# EAGLE design uino-328th (EAGLE 7.7.0)
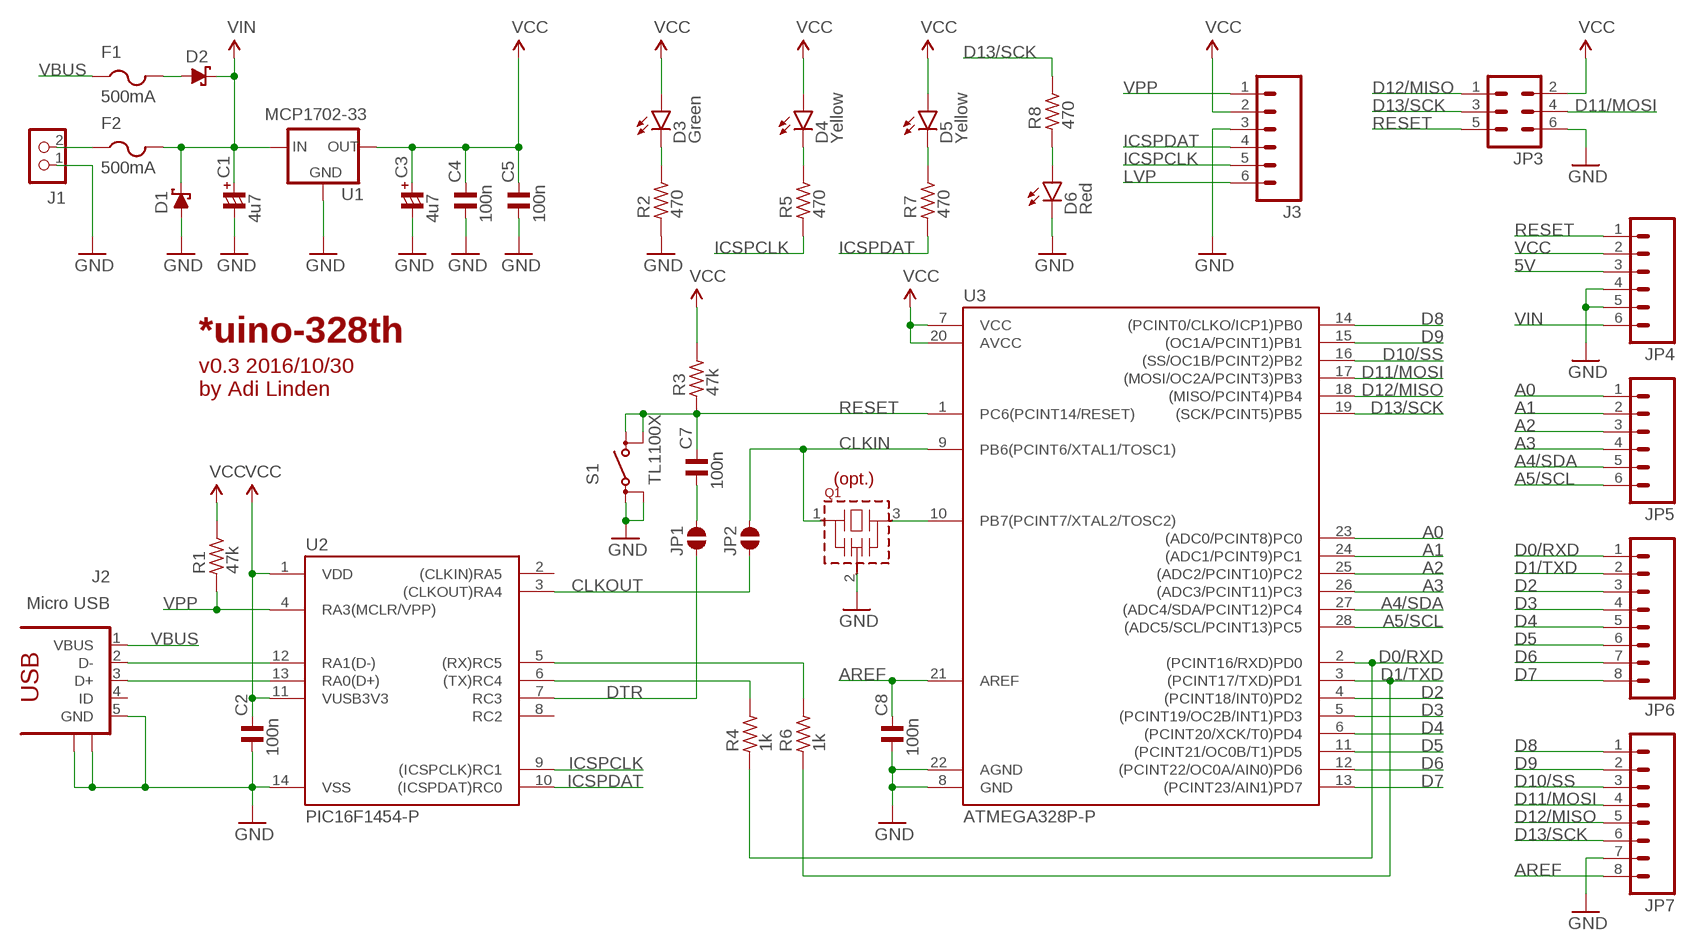
[diagram p0: schematic, sheet 1]

## Parts
C1  4u7  CP_TT025-040  [CTT-025-040]
C2  100n  C_C025-040X018  [C025-040X018]
C3  4u7  CP_TT025-040  [CTT-025-040]
C4  100n  C_C025-040X018  [C025-040X018]
C5  100n  C_C025-040X018  [C025-040X018]
C7  100n  C_C025-040X018  [C025-040X018]
C8  100n  C_C025-040X018  [C025-040X018]
D1  SCHOTTKY-DIODEDO35-7  [DO35-7]
D2  SCHOTTKY-DIODEDO35-7  [DO35-7]
D3  Green  LED3MM  [LED3MM]
D4  Yellow  LED3MM  [LED3MM]
D5  Yellow  LED3MM  [LED3MM]
D6  Red  LED3MM  [LED3MM]
F1  500mA  FUSE_PTC-TH  [PTC]
F2  500mA  FUSE_PTC-TH  [PTC]
J1  CON_TERMINAL_BLOCK_02-5MM  [TERMINAL_BLOCK_2P_5]
J2  Micro USB  USB_MICRO_B_2.0-TH  [ZX62D-AB-5P8]
J3  M06LOCK  [1X06_LOCK]
JP1  SJ-035  [SJ-035]
JP2  SJ-035  [SJ-035]
JP3  M03X2  [2X03]
JP4  M06SIP  [1X06]
JP5  M06SIP  [1X06]
JP6  M081X08  [1X08]
JP7  M081X08  [1X08]
Q1  CSTLS_X  [CSTLS_X]
R1  47k  R_X0207/7  [0207/7]
R2  470  R_X0207/7  [0207/7]
R3  47k  R_X0207/7  [0207/7]
R4  1k  R_X0207/10  [0207/10]
R5  470  R_X0207/7  [0207/7]
R6  1k  R_X0207/10  [0207/10]
R7  470  R_X0207/7  [0207/7]
R8  470  R_X0207/10  [0207/10]
S1  TL1100X  [TL1100X]
U1  MCP1702-33  V_REG_MCP170X  [TO-92]
U2  PIC16F1454-P  [DIL14]
U3  ATMEGA328P-P  [DIL28-3]

## Nets
5V: JP4.3
A0: JP5.1 U3.23((ADC0/PCINT8)PC0)
A1: JP5.2 U3.24((ADC1/PCINT9)PC1)
A2: JP5.3 U3.25((ADC2/PCINT10)PC2)
A3: JP5.4 U3.26((ADC3/PCINT11)PC3)
A4/SDA: JP5.5 U3.27((ADC4/SDA/PCINT12)PC4)
A5/SCL: JP5.6 U3.28((ADC5/SCL/PCINT13)PC5)
AREF: C8.2 JP7.8 U3.21(AREF)
CLKIN: JP2.2 Q1.1 U3.9(PB6(PCINT6/XTAL1/TOSC1))
CLKOUT: JP2.1 U2.3((CLKOUT)RA4)
D0/RXD: JP6.1 R4.1 U3.2((PCINT16/RXD)PD0)
D1/TXD: JP6.2 R6.1 U3.3((PCINT17/TXD)PD1)
D2: JP6.3 U3.4((PCINT18/INT0)PD2)
D3: JP6.4 U3.5((PCINT19/OC2B/INT1)PD3)
D4: JP6.5 U3.6((PCINT20/XCK/T0)PD4)
D5: JP6.6 U3.11((PCINT21/OC0B/T1)PD5)
D6: JP6.7 U3.12((PCINT22/OC0A/AIN0)PD6)
D7: JP6.8 U3.13((PCINT23/AIN1)PD7)
D8: JP7.1 U3.14((PCINT0/CLKO/ICP1)PB0)
D9: JP7.2 U3.15((OC1A/PCINT1)PB1)
D10/SS: JP7.3 U3.16((SS/OC1B/PCINT2)PB2)
D11/MOSI: JP3.4 JP7.4 U3.17((MOSI/OC2A/PCINT3)PB3)
D12/MISO: JP3.1 JP7.5 U3.18((MISO/PCINT4)PB4)
D13/SCK: JP3.3 JP7.6 R8.2 U3.19((SCK/PCINT5)PB5)
DTR: JP1.1 U2.7(RC3)
GND: C1.- C2.1 C3.- C4.1 C5.1 C8.1 D1.A D6.K(C) J1.1 J2.5(GND) J2.S1 J2.S2 J3.3 JP3.6 JP4.4 JP4.5 JP7.7 Q1.2(VSS) R2.1 S1.1(P) S1.2(P1) U1.1(GND) U2.14(VSS) U3.8(GND) U3.22(AGND)
ICSPCLK: J3.5 R5.1 U2.9((ICSPCLK)RC1)
ICSPDAT: J3.4 R7.1 U2.10((ICSPDAT)RC0)
LVP: J3.6
N$1: D3.K(C) R2.2
N$2: C7.1 JP1.2
N$3: J2.2(D-) U2.12(RA1(D-))
N$4: J2.3(D+) U2.13(RA0(D+))
N$5: D6.A R8.1
N$8: F2.P$1 J1.2
N$9: R4.2 U2.6((TX)RC4)
N$10: R6.2 U2.5((RX)RC5)
N$11: Q1.3 U3.10(PB7(PCINT7/XTAL2/TOSC2))
N$12: D4.K(C) R5.2
N$13: D5.K(C) R7.2
N$14: D2.A F1.P$2
RESET: C7.2 JP3.5 JP4.1 R3.1 S1.3(S) S1.4(S1) U3.1(PC6(PCINT14/RESET))
VBUS: F1.P$1 J2.1(VBUS)
VCC: C2.2 C3.+ C4.2 C5.2 D3.A D4.A D5.A J3.2 JP3.2 JP4.2 R1.2 R3.2 U1.3(OUT) U2.1(VDD) U2.11(VUSB3V3) U3.7(VCC) U3.20(AVCC)
VIN: C1.+ D1.C D2.C F2.P$2 JP4.6 U1.2(IN)
VPP: J3.1 R1.1 U2.4(RA3(MCLR/VPP))
Unconnected: J2.4(ID) U2.2((CLKIN)RA5) U2.8(RC2)

## Notes on the sheet
- *uino-328th
- v0.3 2016/10/30
  by Adi Linden
- (opt.)

## Library data of the parts
C1 C3 = rc-master-th:CP_: POLARIZED CAP
C2 C4 C5 C7 C8 = rc-master-th:C_: NON-POLARIZED CAP
D1 D2 = diode:SCHOTTKY-DIODE: Schottky Diode
D3-D6 = SparkFun-LED:LED: LEDs Standard schematic elements and footprints for 5mm, 3mm, 1206, and 0603 sized LEDs. 5mm - Spark Fun Electronics SKU : COM-00529 (and others); PROD_ID: DIO-08794
F1 F2 = adi-misc:FUSE_PTC: PTC fuses, resettable thermistors
J1 = adi-misc:CON_TERMINAL_BLOCK_02: 2 poles wire to board terminal block
J2 = adi-misc:USB_MICRO_B_2.0-TH: USB Micro AB OTG Receptacle Hirose ZX62D-AB-5P8 Amphenol FCI 10118194-0001LF
J3 = SparkFun-Connectors:M06: Header 6 Standard 6-pin 0.1" header. Use with straight break away headers (SKU : PRT-00116), right angle break away headers (PRT-00553), swiss pins (PRT-00743), machine pins (PRT-00117), and female headers (PRT-00115). Molex polarized connector foot print use with SKU : PRT-08094 with associated ...
JP1 JP2 = jumpers:SJ-: Solder Jumper
JP3 = adi-misc:M03X2: This is a 3x2 pin header Note: This part is based on the Sparkfun M04X2 header.
JP4 JP5 = SparkFun:M06: Header 6 Standard 6-pin 0.1" header. Use with straight break away headers (SKU : PRT-00116), right angle break away headers (PRT-00553), swiss pins (PRT-00743), machine pins (PRT-00117), and female headers (PRT-00115). Molex polarized connector foot print use with SKU : PRT-08094 with associated ...
JP6 JP7 = SparkFun:M08: Header 8 Standard 8-pin 0.1" header. Use with straight break away headers (SKU : PRT-00116), right angle break away headers (PRT-00553), swiss pins (PRT-00743), machine pins (PRT-00117), and female headers (PRT-00115).
Q1 = murata-resonators:CSTLS_X: Ceramic resonator 16.00 to 70.00 MHz
R1-R8 = rc-master:R_: RESISTOR
S1 = adi-misc:TL1100X: TACTILE SWITCH
U1 = adi-misc:V_REG_MCP170X
U2 = adi-pic:PIC16F1454
U3 = adi-atmega:ATMEGA328P

## Board
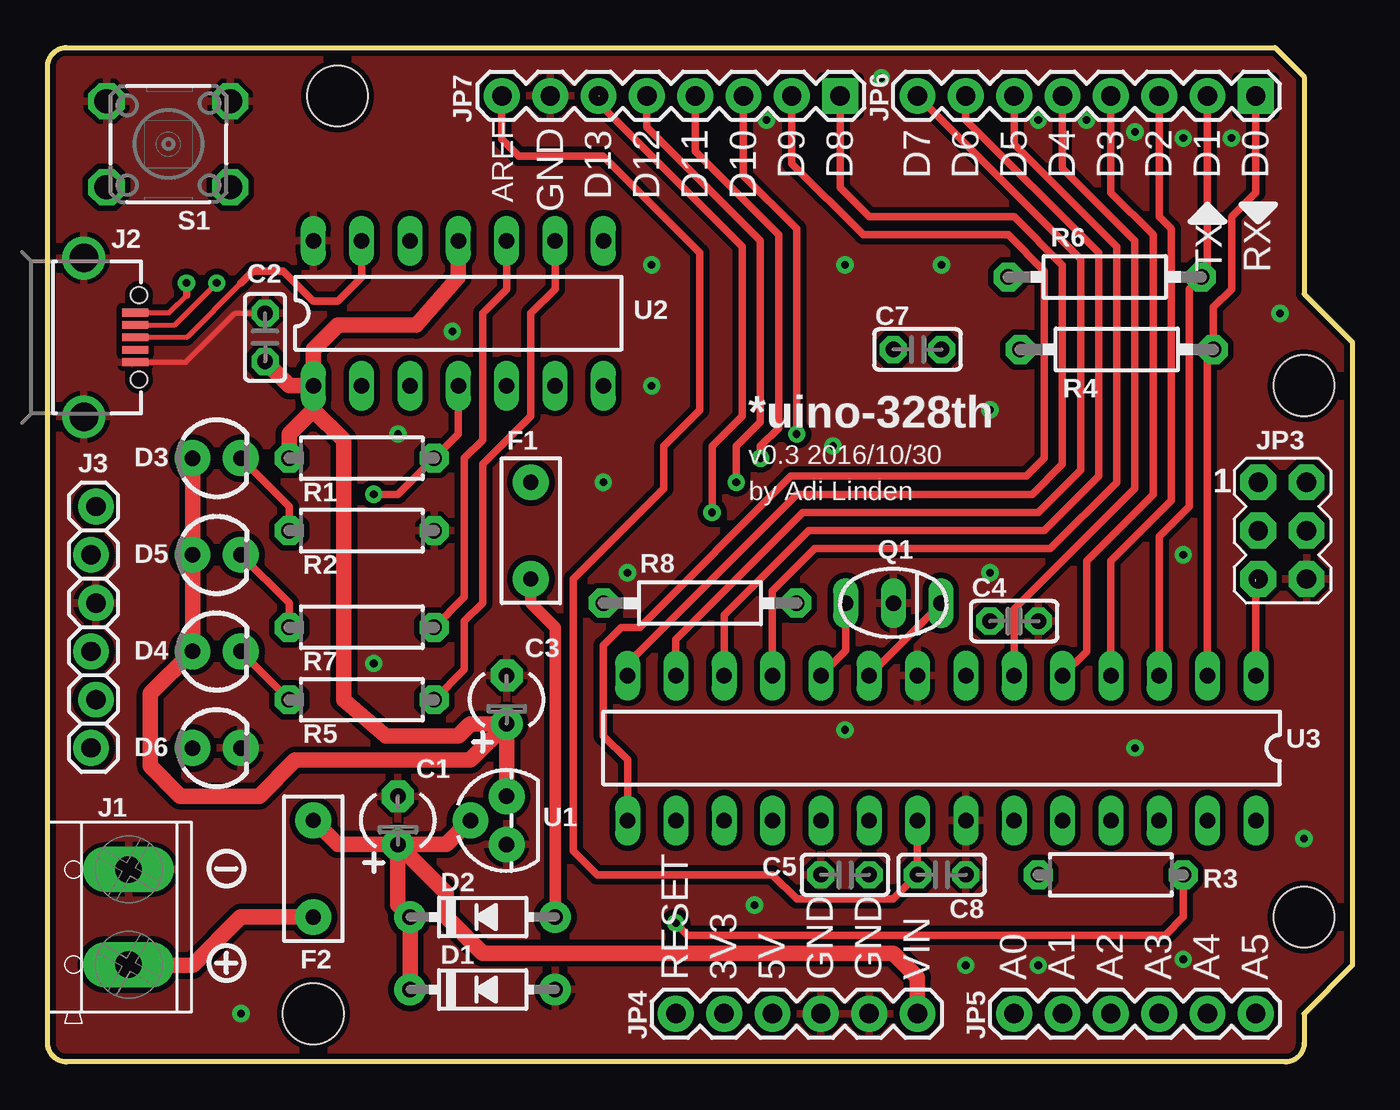
[diagram p1: board, top side]
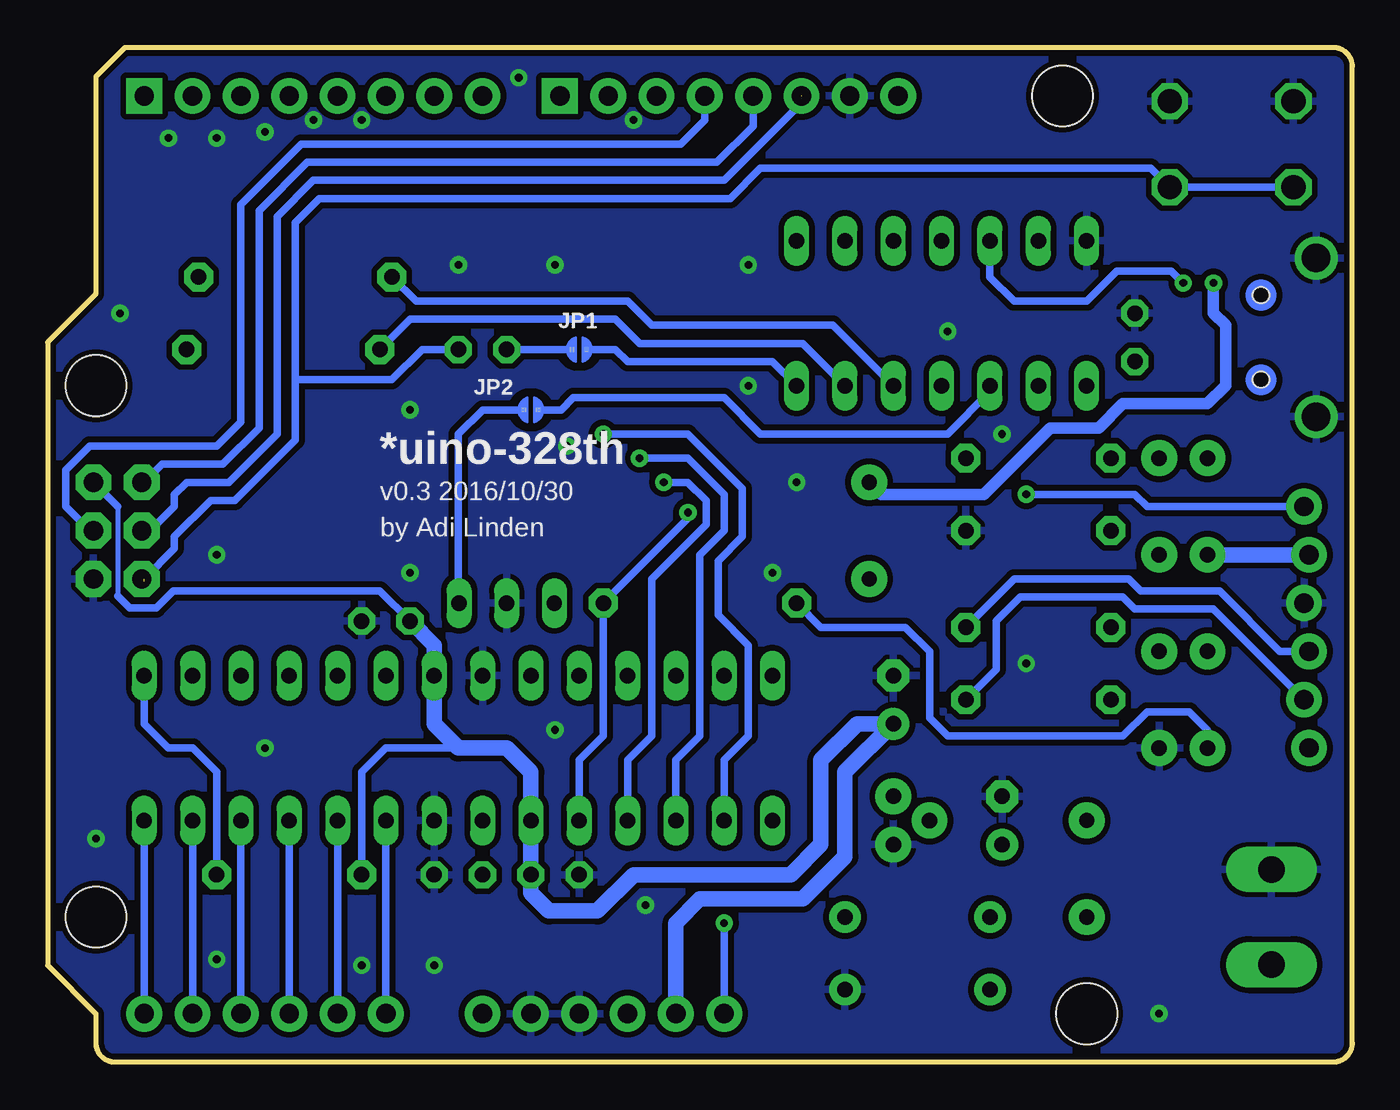
[diagram p2: board, bottom side, seen from below]

Size 68.58 x 53.34 mm. Coordinates in mm from the lower left corner, seen from the top.
Outline: 64.52,53.34 66.04,51.82 66.04,40.39 68.58,37.85 68.58,5.08 66.04,2.54 66.04,1 arc-90 65.04,0 1,0 arc-90 0,1 0,52.34 arc-90 1,53.34 64.52,53.34
Copper layers (1*16): Top 0.035mm / dielectric 1.5mm / Bottom 0.035mm
Design rules "SeeedStudio_2layer_DRU_no_angle_20140221 *": minimum track width 6mil, minimum drill 12mil, track to track 6mil, track to pad 6mil, pad to pad 6mil, via to via 6mil, smd to smd 0mil, copper to edge 10mil, drill to drill 10mil, minimum pad ring 10mil, minimum via ring 10mil, stop-mask expansion 2mil, vias tented up to drill 25mil, thermal gap 10mil
Holes 3.2 mm at 66.04,35.56 66.04,7.62 15.24,50.8 13.97,2.54

### Footprints (pad centres in the part's own frame; a part is rotated, then mirrored left to right if it is on the bottom)
CTT-025-040 = drill 0.813 pad 1.676: + -1.27,0 | drill 0.813 pad 1.676 octagon: - 1.27,0
C025-040X018 = drill 0.813 pad 1.422 octagon: 1 -1.27,0; 2 1.27,0
DO35-7 = drill 0.813 pad 1.676: A 3.81,0; C -3.81,0
LED3MM = drill 0.813 pad 1.88: A -1.27,0; K 1.27,0
PTC = drill 0.8 pad 1.88: P$1 -2.54,0; P$2 2.54,0
TERMINAL_BLOCK_2P_5 = drill 1.4 pad 2.38 long: 1 2.5,-0.45; 2 -2.5,-0.45
ZX62D-AB-5P8 = smd 0.4 x 1.35: 1 -1.3,2.7; 2 -0.65,2.7; 3 0,2.7; 4 0.65,2.7; 5 1.3,2.7 | drill 1.5: S1 -4.175,0; S2 4.175,0 | hole 0.85: -2.225,2.9; 2.225,2.9
1X06_LOCK = drill 1.016 pad 1.88: 1 0,0; 2 2.54,-0.254; 3 5.08,0; 4 7.62,-0.254; 5 10.16,0; 6 12.7,-0.254
SJ-035 = smd 0.254 x 0.254: 1 -0.381,0; 2 0.381,0
2X03 = drill 1.016 pad 1.88 octagon: 1 -2.54,-1.27; 2 -2.54,1.27; 3 0,-1.27; 4 0,1.27; 5 2.54,-1.27; 6 2.54,1.27
1X06 = drill 1.016 pad 1.88: 1 0,0; 2 2.54,0; 3 5.08,0; 4 7.62,0; 5 10.16,0; 6 12.7,0
1X08 = drill 1.016 pad 1.88 square: 1 0,0 | drill 1.016 pad 1.88: 2 2.54,0; 3 5.08,0; 4 7.62,0; 5 10.16,0; 6 12.7,0; 7 15.24,0; 8 17.78,0
CSTLS_X = drill 0.813 long: 1 -2.5,0; 2 0,0; 3 2.5,0
0207/7 = drill 0.813 pad 1.524 octagon: 1 -3.81,0; 2 3.81,0
0207/10 = drill 0.813 pad 1.524 octagon: 1 -5.08,0; 2 5.08,0
TL1100X = drill 1.27 octagon: 1 -3.251,-2.261; 2 3.251,-2.261; 3 -3.251,2.261; 4 3.251,2.261
TO-92 = drill 0.813 pad 1.88: 1 -1.27,0; 2 0,1.905; 3 1.27,0
DIL14 = drill 0.813 long: 1 -7.62,-3.81; 2 -5.08,-3.81; 3 -2.54,-3.81; 4 0,-3.81; 5 2.54,-3.81; 6 5.08,-3.81; 7 7.62,-3.81; 8 7.62,3.81; 9 5.08,3.81; 10 2.54,3.81; 11 0,3.81; 12 -2.54,3.81; 13 -5.08,3.81; 14 -7.62,3.81
DIL28-3 = drill 0.813 long: 1 -16.51,-3.81; 2 -13.97,-3.81; 3 -11.43,-3.81; 4 -8.89,-3.81; 5 -6.35,-3.81; 6 -3.81,-3.81; 7 -1.27,-3.81; 8 1.27,-3.81; 9 3.81,-3.81; 10 6.35,-3.81; 11 8.89,-3.81; 12 11.43,-3.81; 13 13.97,-3.81; 14 16.51,-3.81; 15 16.51,3.81; 16 13.97,3.81; 17 11.43,3.81; 18 8.89,3.81; 19 6.35,3.81; 20 3.81,3.81; 21 1.27,3.81; 22 -1.27,3.81; 23 -3.81,3.81; 24 -6.35,3.81; 25 -8.89,3.81; 26 -11.43,3.81; 27 -13.97,3.81; 28 -16.51,3.81

### Placement (x,y rotation side)
C1  18.41,12.7 90 top
C2  11.43,38.1 270 top
C3  24.13,19.05 90 top
C4  50.8,23.18 180 top
C5  41.91,9.84 0 top
C7  45.72,37.47 0 top
C8  46.99,9.84 180 top
D1  22.86,3.81 0 top
D2  22.86,7.62 0 top
D3  8.89,31.75 0 top
D4  8.89,21.59 0 top
D5  8.89,26.67 0 top
D6  8.89,16.51 0 top
F1  25.4,27.94 270 top
F2  13.97,10.16 90 top
J1  3.81,7.62 90 top
J2  1.91,38.1 270 top
J3  2.54,29.21 270 top
JP1  40.64,37.47 180 bottom
JP2  43.18,34.29 180 bottom
JP3  64.9,27.94 270 top
JP4  33.02,2.54 0 top
JP5  50.8,2.54 0 top
JP6  63.5,50.8 180 top
JP7  41.66,50.8 180 top
Q1  44.45,24.13 180 top
R1  16.51,31.75 180 top
R2  16.51,27.94 180 top
R3  55.88,9.84 180 top
R4  56.2,37.47 180 top
R5  16.51,19.05 180 top
R6  55.56,41.27 180 top
R7  16.51,22.86 180 top
R8  34.29,24.13 0 top
S1  6.35,48.26 180 top
U1  24.13,12.7 90 top
U2  21.59,39.37 0 top
U3  46.99,16.51 180 top

### Tracks (layer width: path | path; a pad name or v marks a point on that pad's centre or on a via)
A0
  Bottom 0.406: U3.23 JP5.1
A1
  Bottom 0.406: U3.24 JP5.2
A2
  Bottom 0.406: U3.25 JP5.3
A3
  Bottom 0.406: U3.26 JP5.4
A4/SDA
  Bottom 0.406: U3.27 JP5.5
A5/SCL
  Bottom 0.406: U3.28 JP5.6
AREF
  Top 0.406: JP7.8 23.88,48.51 24.77,47.62 29.21,47.62 34.29,42.55 34.29,34.29 32.38,32.38 32.38,30.16 27.62,25.4 27.62,11.11 28.89,9.84 38.1,9.84 39.37,8.57 44.45,8.57 C8.2 U3.21
CLKIN
  Top 0.406: Q1.1 46.95,24.09 U3.9
  Bottom 0.406: JP2.2 45.72,34.29 46.99,33.02 46.99,24.17 Q1.1
CLKOUT
  Bottom 0.406: JP2.1 41.59,34.29 40.96,34.92 33.02,34.92 31.11,33.02 21.27,33.02 19.05,35.24 U2.3
D0/RXD
  Top 0.406: U3.2 60.96,37.15 R4.1 61.28,39.69 62.23,40.64 62.23,44.45 63.5,45.72 JP6.1
D1/TXD
  Top 0.406: U3.3 58.42,27.62 60.01,29.21 60.01,40.64 R6.1 60.96,41.59 JP6.2
D2
  Top 0.406: U3.4 55.88,26.35 59.05,29.53 59.05,43.81 58.42,44.45 JP6.3
D3
  Top 0.406: JP6.4 55.88,45.72 58.1,43.5 58.1,29.84 54.61,26.35 54.61,21.59 U3.5
D4
  Top 0.406: JP6.5 53.34,46.99 57.15,43.18 57.15,30.16 50.8,23.81 U3.6
D5
  Top 0.406: U3.11 38.1,24.77 40.32,26.99 52.7,26.99 56.2,30.48 56.2,42.86 50.8,48.26 JP6.6
D6
  Top 0.406: U3.12 35.56,23.5 40.01,27.94 52.39,27.94 55.24,30.8 55.24,42.55 48.26,49.53 JP6.7
D7
  Top 0.406: U3.13 33.02,22.23 39.69,28.89 52.07,28.89 54.29,31.11 54.29,42.23 JP6.8
D8
  Top 0.406: JP7.1 41.66,45.97 43.18,44.45 50.8,44.45 53.34,41.91 53.34,31.43 51.75,29.84 39.37,29.84 30.48,20.95 U3.14
D9
  Top 0.406: JP7.2 39.12,47.24 42.86,43.5 50.48,43.5 52.39,41.59 52.39,31.75 51.44,30.8 39.05,30.8 31.11,22.86 30.16,22.86 29.21,21.91 29.21,17.14 30.48,15.88 U3.15
D10/SS  (via drill 0.4)
  Top 0.406: JP7.3 36.58,46.61 39.37,43.81 v39.37,33.02
  Bottom 0.406: v39.37,33.02 34.92,33.02 32.07,30.16 32.07,27.62 33.34,26.35 33.34,23.5 31.75,21.91 31.75,17.14 33.02,15.88 U3.16
D11/MOSI  (via drill 0.4)
  Top 0.406: JP7.4 34.04,47.88 38.42,43.5 38.42,33.34 37.47,32.38 v37.47,31.75
  Bottom 0.406: v37.47,31.75 34.92,31.75 33.02,29.84 33.02,27.94 34.29,26.67 34.29,17.14 35.56,15.88 U3.17 | JP3.4 66.36,27.94 67.63,29.21 67.63,31.11 66.36,32.38 59.69,32.38 58.42,33.66 58.42,45.09 55.24,48.26 35.31,48.26 34.04,49.53 JP7.4
D12/MISO  (via drill 0.4)
  Top 0.406: JP7.5 31.5,49.15 37.47,43.18 37.47,33.66 36.2,32.38 v36.2,30.48
  Bottom 0.406: v36.2,30.48 34.92,30.48 33.97,29.53 33.97,28.26 36.83,25.4 36.83,17.14 38.1,15.88 U3.18 | JP3.1 63.5,30.48 62.55,31.43 59.37,31.43 57.47,33.34 57.47,44.77 54.93,47.31 33.4,47.31 31.5,49.21 JP7.5
D13/SCK  (via drill 0.4)  (1 unrouted)
  Top 0.406: JP7.6 28.96,50.42 36.51,42.86 36.51,33.97 34.92,32.38 v34.92,28.89
  Bottom 0.406: U3.19 40.64,15.88 39.37,17.14 R8.2 34.92,28.57 v34.92,28.89 | JP3.3 63.18,27.94 61.91,29.21 61.91,29.84 61.28,30.48 59.05,30.48 56.52,33.02 56.52,44.45 54.61,46.35 33.02,46.35 28.96,50.41 JP7.6
DTR
  Bottom 0.406: JP1.1 38.73,37.47 38.1,36.83 30.48,36.83 U2.7
GND  (via drill 0.4)
  Top 0.254: J2.5 7.27,36.8 9.84,39.37 C2.1
  other vias: 29.21,30.48 31.75,41.91 30.48,25.72 17.14,20.95 10.16,2.54 37.15,8.26 48.26,5.08 59.69,5.4 52.07,5.08 66.04,11.75 57.15,16.51 41.27,32.38 49.53,34.29 46.99,41.91 41.91,41.91 64.77,39.37 31.75,35.56 18.41,33.02 43.81,51.75 41.91,17.46 49.53,25.72 59.69,26.67 62.23,48.58 59.69,48.58 54.61,49.53 57.15,48.9 52.07,49.53 37.78,49.53 21.27,38.42
  pour Top (isolate 0.305): 0,0 68.58,0 68.58,53.34 0,53.34
  pour Bottom (isolate 0.305): 0,0 68.58,0 68.58,53.34 0,53.34
ICSPCLK
  Top 0.406: U2.9 26.67,40.64 25.4,39.37 25.4,33.97 22.86,31.43 22.86,24.13 21.91,23.18 21.91,20.64 R5.1
  Bottom 0.406: J3.5 7.3,23.81 11.43,23.81 12.06,24.45 17.46,24.45 18.73,23.18 18.73,20.64 R5.1
ICSPDAT
  Top 0.406: U2.10 24.13,40.64 22.86,39.37 22.86,32.7 21.91,31.75 21.91,24.45 R7.1
  Bottom 0.406: J3.4 3.81,21.59 6.99,24.77 11.11,24.77 11.75,25.4 17.78,25.4 R7.1
N$1
  Top 0.406: D3.K 12.7,29.21 R2.2
N$2
  Bottom 0.406: JP1.2 C7.1
N$3  (via drill 0.4)
  Top 0.254: J2.2 6.68,38.75 v8.89,40.96
  Bottom 0.406: v8.89,40.96 9.53,41.59 12.38,41.59 13.97,40.01 17.78,40.01 19.05,41.27 U2.12
N$4
  Top 0.254: 10.16,40.96 7.3,38.1 J2.3
  Top 0.406: U2.13 16.51,41.27 15.24,40.01 13.97,40.01 12.38,41.59 10.79,41.59 10.16,40.96
N$5
  Bottom 0.406: R8.1 27.94,22.86 23.5,22.86 22.23,21.59 22.23,18.1 21.27,17.14 12.06,17.14 10.79,18.41 8.57,18.41 7.62,17.46 D6.A
N$8
  Top 0.813: J1.2 3.85,5.12 3.81,5.08 7.62,5.08 10.16,7.62 F2.P$1
N$9
  Bottom 0.406: R4.2 49.53,39.05 38.73,39.05 37.47,37.78 28.89,37.78 U2.6
N$10
  Bottom 0.406: R6.2 49.21,40.01 38.1,40.01 36.83,38.73 27.3,38.73 U2.5
N$11
  Top 0.406: Q1.3 41.95,21.63 U3.10
N$12
  Top 0.406: D4.K R5.2
N$13
  Top 0.406: D5.K 12.7,24.13 R7.2
N$14
  Top 0.61: F1.P$2 25.4,24.13 26.67,22.86 D2.A
RESET  (via drill 0.4)  (1 unrouted)
  Top 0.406: v33.02,7.3 33.66,6.67 58.74,6.67 59.69,7.62 R3.1 | 63.5,25.27 U3.1
  Bottom 0.406: S1.4 S1.3 10.59,46.99 31.11,46.99 32.7,45.4 54.29,45.4 55.56,44.13 55.56,35.88 | U3.1 63.5,17.78 62.23,16.51 60.96,16.51 59.69,15.24 R3.1 | JP4.1 v33.02,7.3 | 55.56,35.88 55.56,32.7 58.74,29.53 60.01,29.53 61.91,27.62 61.91,26.99 63.5,25.4 JP3.5 | C7.2 48.9,37.47 50.48,35.88 55.56,35.88
VBUS  (via drill 0.4)
  Top 0.254: 7.3,40.32 6.38,39.4 J2.1
  Top 0.406: 7.3,40.32 v7.3,40.96
  Bottom 0.61: v7.3,40.96 7.3,39.37 6.67,38.73 6.67,35.56 7.62,34.61 12.06,34.61 13.34,33.34 15.88,33.34 19.37,29.84 24.77,29.84 F1.P$1
VCC
  Top 0.813: D3.A D5.A D4.A 5.4,19.37 5.4,15.56 6.99,13.97 11.11,13.97 13.02,15.88 22.23,15.88 C3.+ | C3.+ U1.3 | U2.1 13.97,34.29 | 13.97,34.29 15.56,32.7 15.56,19.05 17.78,17.14 21.59,17.14 22.23,17.78 C3.+ | R1.2 12.7,33.02 13.97,34.29 | U2.11 21.59,41.27 19.37,38.73 15.24,38.73 13.97,37.47 U2.1 | C2.2 12.7,35.56 U2.1
  Bottom 0.254: 64.9,29.21 64.9,24.51
  Bottom 0.406: R3.2 52.07,15.24 50.8,16.51 46.99,16.51 | JP3.2 64.9,29.21 | 64.9,24.51 64.26,23.88 62.87,23.88 61.98,24.77 51.12,24.77 C4.2
  Bottom 0.813: J3.2 D5.A | C4.2 48.26,21.91 U3.7 48.26,17.78 46.99,16.51 44.45,16.51 43.18,15.24 U3.20 C5.2 43.18,8.89 42.23,7.94 39.69,7.94 37.78,9.84 29.53,9.84 27.94,11.43 27.94,15.88 26.04,17.78 C3.+ 26.67,15.24 26.67,10.79 28.89,8.57 34.29,8.57 35.56,7.3 JP4.2
VIN
  Top 0.813: C1.+ 20.95,11.43 U1.2 | F2.P$2 15.24,11.43 C1.+ | C1.+ 18.41,8.26 D2.C D1.C | JP4.6 45.72,4.45 44.45,5.71 22.86,5.71 20.95,7.62 20.95,8.89 C1.+
VPP  (via drill 0.4)
  Top 0.406: U2.4 21.59,33.02 R1.1 18.41,29.84 v17.14,29.84
  Bottom 0.406: v17.14,29.84 11.43,29.84 10.79,29.21 J3.1

### Text on the board
tPlace: AREF | GND | D13 | D12 | D11 | D10 | D9 | D8 | D7 | D6 | D5 | D4 | D3 | D2 | D1 | D0 | TX | RX | *uino-328th | v0.3 2016/10/30 | by Adi Linden | RESET | 3V3 | 5V | GND | GND | VIN | A0 | A1 | A2 | A3 | A4 | A5
bPlace: *uino-328th | v0.3 2016/10/30 | by Adi Linden
tNames: 1